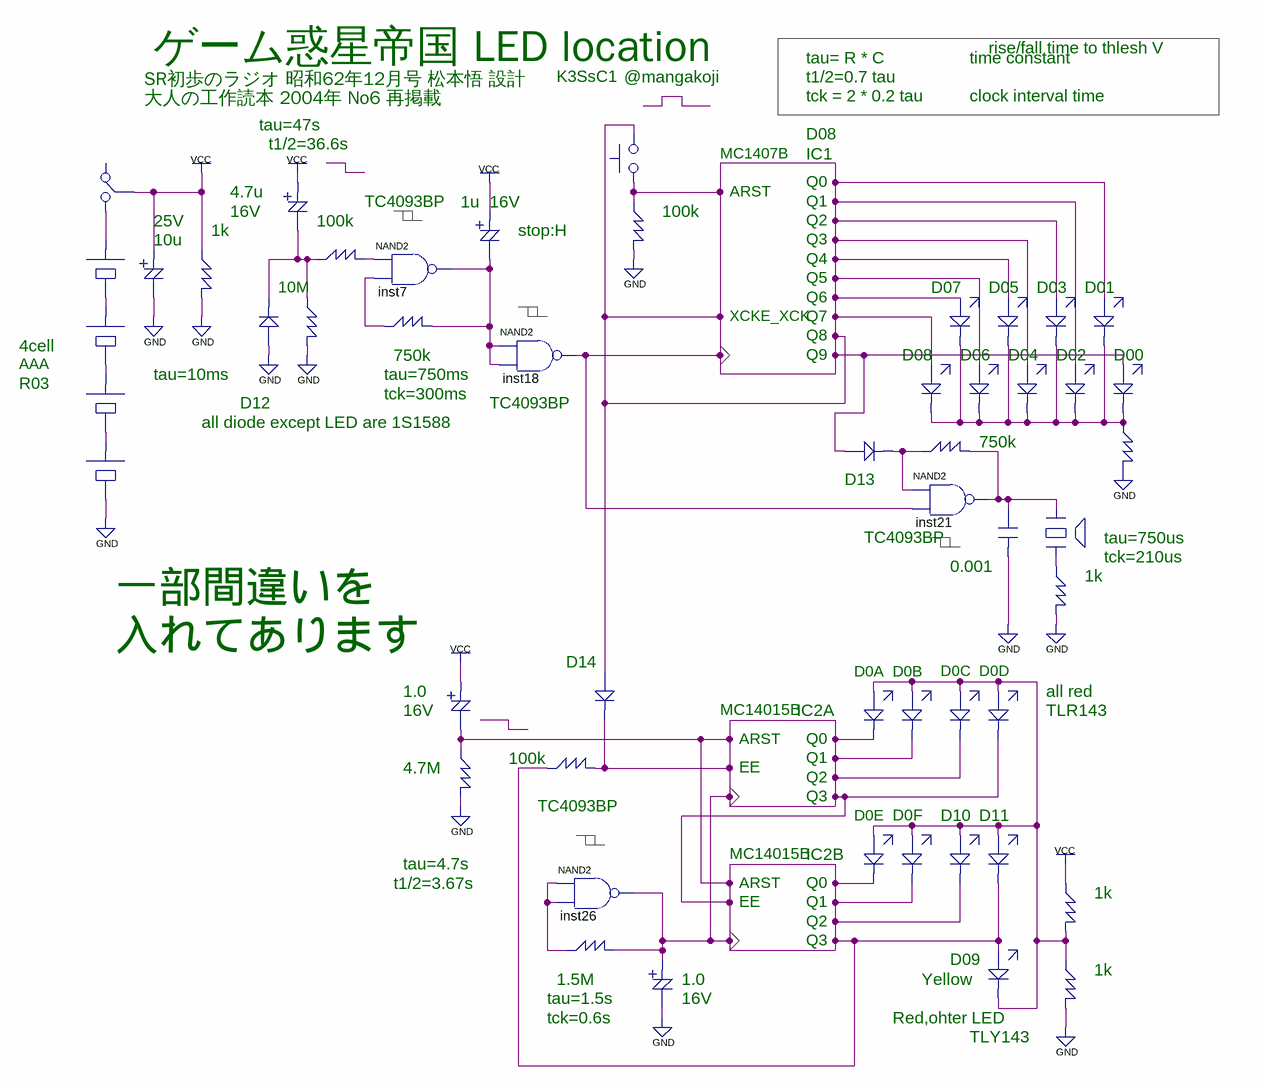
[diagram p0: schematic sheet]
// Quartus schematic chart.bdf as structural Verilog: 51 symbols, 0 pins
module chart (
);

  wire inst1_y, inst3_y, inst4_y, inst5_y, inst6_y, inst7_out, inst8_y, inst10_y, inst16_y, inst18_out,
       inst22_y, inst23_y, inst24_y, inst27_y, inst40_y, inst42_y, inst43_y, inst46_y, inst47_y, inst51_y,
       inst65_y, inst66_y, inst67_y, inst76_y, inst77_y, undriven, undriven_2;
  wire [7:0] inst19_y;

  TSW inst3 (.B(inst1_y), .Y(inst3_y));  // open: A
  bat inst (.A(inst65_y), .Y(inst3_y));
  CC inst1 (.A(1'b0), .Y(inst1_y));
  bat inst65 (.A(inst66_y), .Y(inst65_y));
  bat inst66 (.A(inst67_y), .Y(inst66_y));
  bat inst67 (.A(1'b0), .Y(inst67_y));
  R inst4 (.A(inst1_y), .Y(inst4_y));
  CC inst16 (.A(inst5_y), .Y(inst16_y));
  DIOD inst5 (.A(1'b0), .Y(inst5_y));
  R inst6 (.A(inst5_y), .Y(inst6_y));
  R inst10 (.A(inst5_y), .Y(inst10_y));
  nand inst7 (inst7_out, inst10_y, undriven_2);
  R inst9 (.A(undriven_2), .Y(inst7_out));
  CC inst27 (.A(inst46_y), .Y(inst27_y));
  R inst47 (.A(inst46_y), .Y(inst47_y));
  CC inst8 (.A(inst7_out), .Y(inst8_y));
  nand inst18 (inst18_out, inst7_out, inst7_out);
  DIOD inst46 (.A(inst18_out), .Y(inst46_y));
  R inst55 (.A(inst46_y), .Y(inst46_y));
  nand inst26 (inst46_y, undriven, undriven);
  R inst25 (.A(undriven), .Y(inst46_y));
  PSW inst38 (.A(inst18_out), .Y(inst18_out));
  R inst22 (.A(inst18_out), .Y(inst22_y));
  CC inst49 (.A(1'b0), .Y(inst46_y));
  DIOD inst42 (.A(inst18_out), .Y(inst42_y));
  LED inst68 (.A(inst76_y), .Y(inst46_y));
  LED inst69 (.A(inst76_y), .Y(inst46_y));
  LED inst72 (.A(inst76_y), .Y(inst46_y));
  LED inst73 (.A(inst76_y), .Y(inst46_y));
  LED inst77 (.A(inst18_out), .Y(inst77_y));
  LED inst81 (.A(inst18_out), .Y(inst77_y));
  LED inst82 (.A(inst18_out), .Y(inst77_y));
  R inst24 (.A(inst42_y), .Y(inst24_y));
  nand inst21 (inst24_y, inst42_y, inst18_out);
  LED inst70 (.A(inst76_y), .Y(inst46_y));
  LED inst71 (.A(inst76_y), .Y(inst46_y));
  LED inst74 (.A(inst76_y), .Y(inst46_y));
  LED inst75 (.A(inst76_y), .Y(inst46_y));
  LED inst76 (.A(inst46_y), .Y(inst76_y));
  LED inst78 (.A(inst18_out), .Y(inst77_y));
  LED inst79 (.A(inst18_out), .Y(inst77_y));
  LED inst83 (.A(inst18_out), .Y(inst77_y));
  LED inst84 (.A(inst18_out), .Y(inst77_y));
  PSW inst40 (.A(inst24_y), .Y(inst40_y));
  c inst43 (.A(inst24_y), .Y(inst43_y));
  R inst23 (.A(inst40_y), .Y(inst23_y));
  R inst54 (.A(1'b1), .Y(inst76_y));
  R inst51 (.A(inst76_y), .Y(inst51_y));
  LED inst80 (.A(inst18_out), .Y(inst77_y));
  LED inst85 (.A(inst18_out), .Y(inst77_y));
  R inst19 (.A(inst77_y), .Y(inst19_y));
  // also tied to GND on the sheet: {inst22_y, inst47_y, inst23_y, inst43_y, inst51_y, inst4_y, inst6_y, inst19_y[0], inst19_y[1], inst19_y[2], inst19_y[3], inst19_y[4], inst19_y[5], inst19_y[6], inst19_y[7]}
  // also tied to VCC on the sheet: {inst27_y, inst1_y, inst16_y, inst8_y}

  // Notes on the sheet:
  //   ゲーム惑星帝国 LED location
  //   rise/fall time to thlesh V
  //   tau= R * C
  //   time constant
  //   SR初歩のラジオ 昭和62年12月号 松本悟 設計
  //   K3SsC1
  //   @mangakoji
  //   t1/2=0.7 tau
  //   大人の工作読本 2004年 No6 再掲載
  //   tck = 2 * 0.2 tau
  //   clock interval time
  //   tau=47s
  //   D08
  //   t1/2=36.6s
  //   MC1407B
  //   IC1
  //   Q0
  //   4.7u
  //   ARST
  //   TC4093BP
  //   1u
  //   16V
  //   Q1
  //   16V
  //   100k
  //   25V
  //   100k
  //   Q2
  //   1k
  //   stop:H
  //   10u
  //   Q3
  //   Q4
  //   Q5
  //   10M
  //   D07
  //   D05
  //   D03
  //   D01
  //   Q6
  //   XCKE_XCK
  //   Q7
  //   Q8
  //   4cell
  //   750k
  //   Q9
  //   D08
  //   D06
  //   D04
  //   D02
  //   D00
  //   AAA
  //   tau=10ms
  //   tau=750ms
  //   R03
  //   tck=300ms
  //   D12
  //   TC4093BP
  //   all diode except LED are 1S1588
  //   750k
  //   D13
  //   TC4093BP
  //   tau=750us
  //   tck=210us
  //   一部間違いを
  //   0.001
  //   1k
  //   入れてあります
  //   D14
  //   D0A
  //   D0B
  //   D0C
  //   D0D
  //   1.0
  //   all red
  //   16V
  //   MC14015B
  //   IC2A
  //   TLR143
  //   ARST
  //   Q0
  //   100k
  //   Q1
  //   4.7M
  //   EE
  //   Q2
  //   Q3
  //   TC4093BP
  //   D0E
  //   D0F
  //   D10
  //   D11
  //   MC14015B
  //   IC2B
  //   tau=4.7s
  //   t1/2=3.67s
  //   ARST
  //   Q0
  //   1k
  //   EE
  //   Q1
  //   Q2
  //   Q3
  //   D09
  //   1k
  //   1.5M
  //   1.0
  //   Yellow
  //   tau=1.5s
  //   16V
  //   tck=0.6s
  //   Red,ohter LED
  //   TLY143
endmodule
